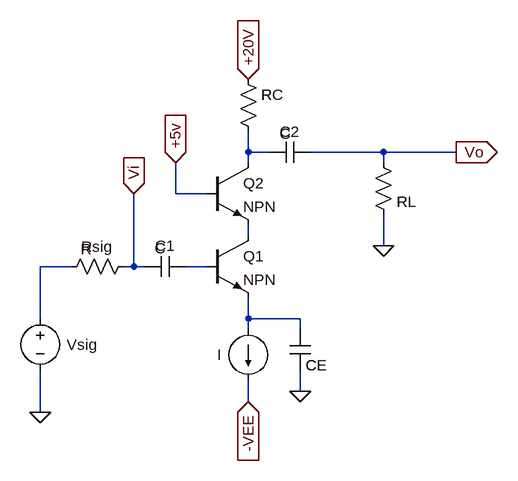
[diagram p0: schematic P1_Chamada.asc]
P1_Chamada.asc, the LTspice schematic file:
Version 4
SHEET 1 880 680
WIRE 272 -48 272 -80
WIRE 304 -48 272 -48
WIRE 480 -48 368 -48
WIRE 592 -48 480 -48
WIRE 272 -32 272 -48
WIRE 480 -32 480 -48
WIRE 160 16 160 -32
WIRE 208 16 160 16
WIRE 272 80 272 64
WIRE 480 96 480 48
WIRE 0 128 -48 128
WIRE 96 128 96 16
WIRE 96 128 80 128
WIRE 112 128 96 128
WIRE 208 128 176 128
WIRE -48 208 -48 128
WIRE 272 208 272 176
WIRE 352 208 272 208
WIRE 272 224 272 208
WIRE 352 224 352 208
WIRE 352 320 352 288
WIRE 272 336 272 304
WIRE -48 352 -48 288
FLAG -48 352 0
FLAG 352 320 0
FLAG 272 336 -VEE
IOPIN 272 336 In
FLAG 160 -32 +5v
IOPIN 160 -32 In
FLAG 272 -160 +20V
IOPIN 272 -160 In
FLAG 480 96 0
FLAG 592 -48 Vo
IOPIN 592 -48 Out
FLAG 96 16 Vi
IOPIN 96 16 In
SYMBOL voltage -48 192 R0
WINDOW 0 41 56 Left 2
WINDOW 3 24 96 Invisible 2
SYMATTR InstName Vsig
SYMATTR Value ""
SYMBOL res 96 112 R90
WINDOW 0 1 57 VBottom 2
WINDOW 3 -26 73 VTop 2
SYMATTR InstName Rsig
SYMBOL cap 176 112 R90
WINDOW 0 0 32 VBottom 2
WINDOW 3 -28 39 VTop 2
SYMATTR InstName C1
SYMBOL cap 336 224 R0
WINDOW 0 24 56 Left 2
SYMATTR InstName CE
SYMBOL cap 368 -64 R90
WINDOW 0 0 32 VBottom 2
WINDOW 3 -28 39 VTop 2
SYMATTR InstName C2
SYMBOL res 256 -176 R0
WINDOW 3 36 40 Left 2
SYMATTR InstName RC
SYMBOL res 464 -48 R0
WINDOW 0 36 76 Left 2
SYMATTR InstName RL
SYMBOL npn 208 80 R0
SYMATTR InstName Q1
SYMBOL npn 208 -32 R0
SYMATTR InstName Q2
SYMBOL current 272 224 R0
WINDOW 0 -48 40 Left 2
WINDOW 3 -64 58 Invisible 2
SYMATTR InstName I
SYMATTR Value ""

The netlist it stands for:
* P1_Chamada.asc
Vsig N003 0
Rsig Vi N003 R
C1 N004 Vi C
CE N005 0 C
C2 Vo N001 C
RC +20V N001 R
RL Vo 0 R
Q1 N002 N004 N005 0 NPN
Q2 N001 +5v N002 0 NPN
I N005 -VEE
.model NPN NPN
.model PNP PNP
.lib standard.bjt
.backanno
.end